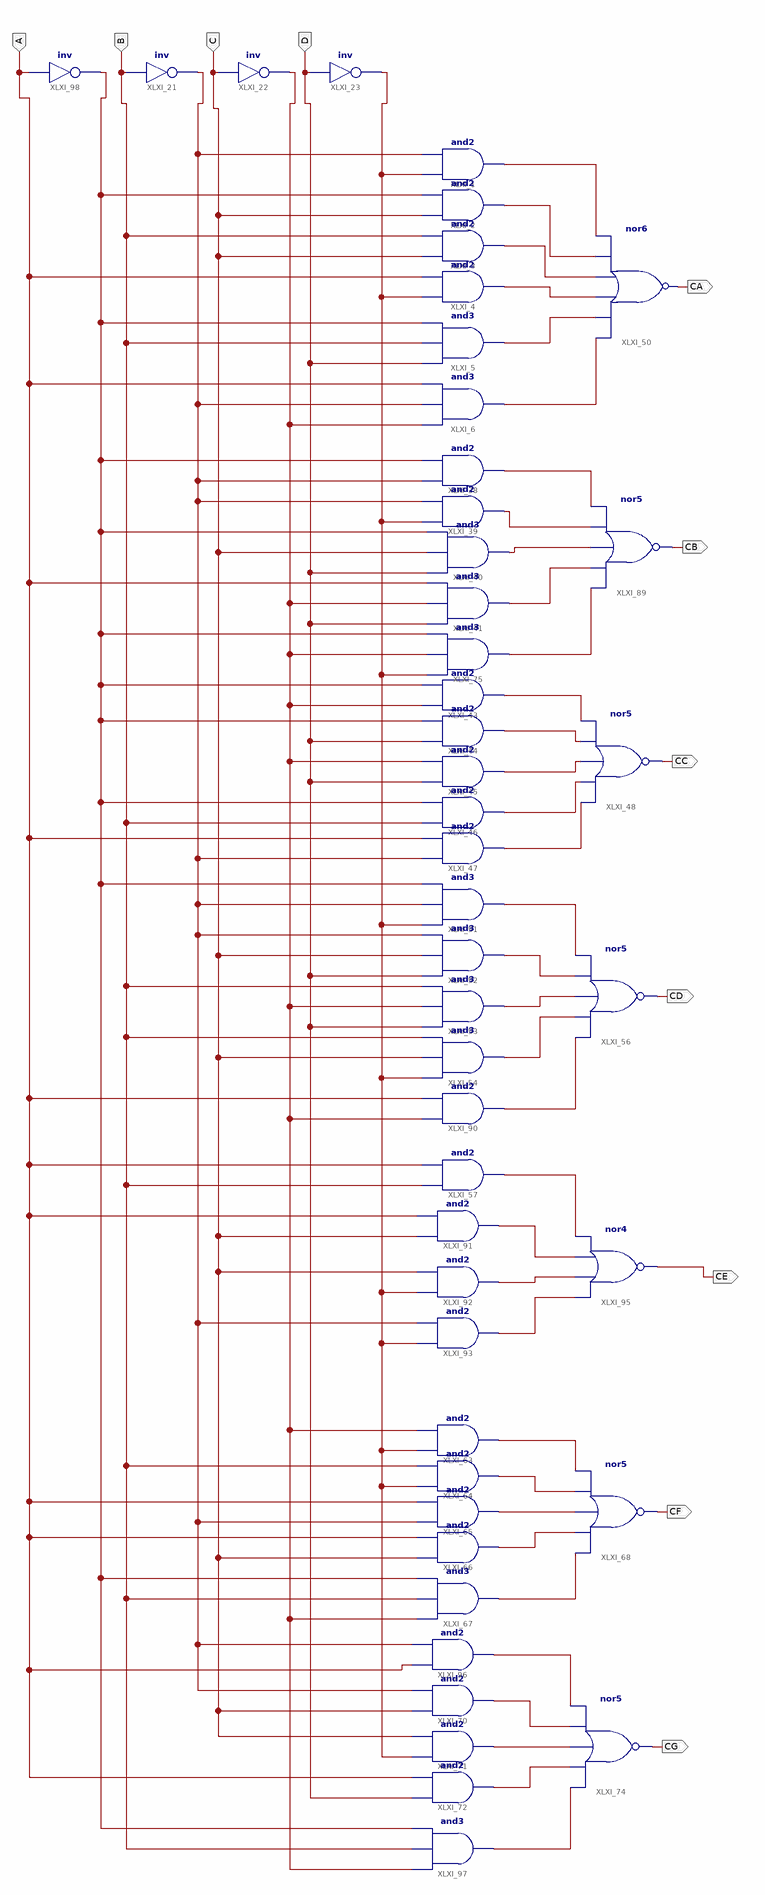
[diagram p0: schematic sheet 1]
// Xilinx ISE schematic Binary_to_Seven.sch (artix7) as structural Verilog: 46 symbols, 11 ports
module Binary_to_Seven (
  input  A,
  input  B,
  input  C,
  input  D,
  output CA,
  output CB,
  output CC,
  output CD,
  output CE,
  output CG,
  output CF
);

  wire XLXN_15, XLXN_16, XLXN_17, XLXN_28, XLXN_29, XLXN_30, XLXN_31, XLXN_32, XLXN_34, XLXN_35, XLXN_37,
       XLXN_38, XLXN_39, XLXN_40, XLXN_62, XLXN_63, XLXN_64, XLXN_65, XLXN_66, XLXN_85, XLXN_86, XLXN_87,
       XLXN_88, XLXN_89, XLXN_107, XLXN_108, XLXN_110, XLXN_111, XLXN_126, XLXN_127, XLXN_128, XLXN_129,
       XLXN_130, XLXN_144, XLXN_145, XLXN_146, XLXN_147, XLXN_148, XLXN_178;

  not XLXI_21 (XLXN_15, B);
  not XLXI_22 (XLXN_28, C);
  not XLXI_23 (XLXN_16, D);
  and XLXI_1 (XLXN_29, XLXN_16, XLXN_15);
  and XLXI_2 (XLXN_30, C, XLXN_17);
  and XLXI_3 (XLXN_31, C, B);
  and XLXI_4 (XLXN_32, XLXN_16, A);
  and XLXI_5 (XLXN_34, D, B, XLXN_17);
  and XLXI_6 (XLXN_35, XLXN_28, XLXN_15, A);
  nor XLXI_48 (CC, XLXN_66, XLXN_65, XLXN_64, XLXN_63, XLXN_62);
  nor XLXI_50 (CA, XLXN_35, XLXN_34, XLXN_32, XLXN_31, XLXN_30, XLXN_29);
  and XLXI_51 (XLXN_85, XLXN_16, XLXN_15, XLXN_17);
  and XLXI_52 (XLXN_86, D, C, XLXN_15);
  and XLXI_53 (XLXN_87, D, XLXN_28, B);
  and XLXI_54 (XLXN_88, XLXN_16, C, B);
  nor XLXI_56 (CD, XLXN_89, XLXN_88, XLXN_87, XLXN_86, XLXN_85);
  and XLXI_57 (XLXN_107, B, A);
  and XLXI_63 (XLXN_126, XLXN_16, XLXN_28);
  and XLXI_64 (XLXN_127, XLXN_16, B);
  and XLXI_65 (XLXN_128, XLXN_15, A);
  and XLXI_66 (XLXN_129, C, A);
  and XLXI_67 (XLXN_130, XLXN_28, B, XLXN_17);
  nor XLXI_68 (CF, XLXN_130, XLXN_129, XLXN_128, XLXN_127, XLXN_126);
  and XLXI_70 (XLXN_145, C, XLXN_15);
  and XLXI_71 (XLXN_146, XLXN_16, C);
  and XLXI_72 (XLXN_147, D, A);
  nor XLXI_74 (CG, XLXN_148, XLXN_147, XLXN_146, XLXN_145, XLXN_144);
  and XLXI_75 (XLXN_40, XLXN_16, XLXN_28, XLXN_17);
  and XLXI_38 (XLXN_37, XLXN_15, XLXN_17);
  and XLXI_39 (XLXN_38, XLXN_16, XLXN_15);
  and XLXI_40 (XLXN_39, D, C, XLXN_17);
  and XLXI_41 (XLXN_178, D, XLXN_28, A);
  and XLXI_43 (XLXN_62, XLXN_28, XLXN_17);
  and XLXI_44 (XLXN_63, D, XLXN_17);
  and XLXI_45 (XLXN_64, D, XLXN_28);
  and XLXI_46 (XLXN_65, B, XLXN_17);
  and XLXI_47 (XLXN_66, XLXN_15, A);
  nor XLXI_89 (CB, XLXN_40, XLXN_178, XLXN_39, XLXN_38, XLXN_37);
  and XLXI_90 (XLXN_89, XLXN_28, A);
  and XLXI_91 (XLXN_108, C, A);
  and XLXI_92 (XLXN_110, XLXN_16, C);
  and XLXI_93 (XLXN_111, XLXN_16, XLXN_15);
  nor XLXI_95 (CE, XLXN_111, XLXN_110, XLXN_108, XLXN_107);
  and XLXI_96 (XLXN_144, A, XLXN_15);
  and XLXI_97 (XLXN_148, XLXN_28, B, XLXN_17);
  not XLXI_98 (XLXN_17, A);
endmodule
